# Altium schematic sheet lock_in.SchDoc
size A4
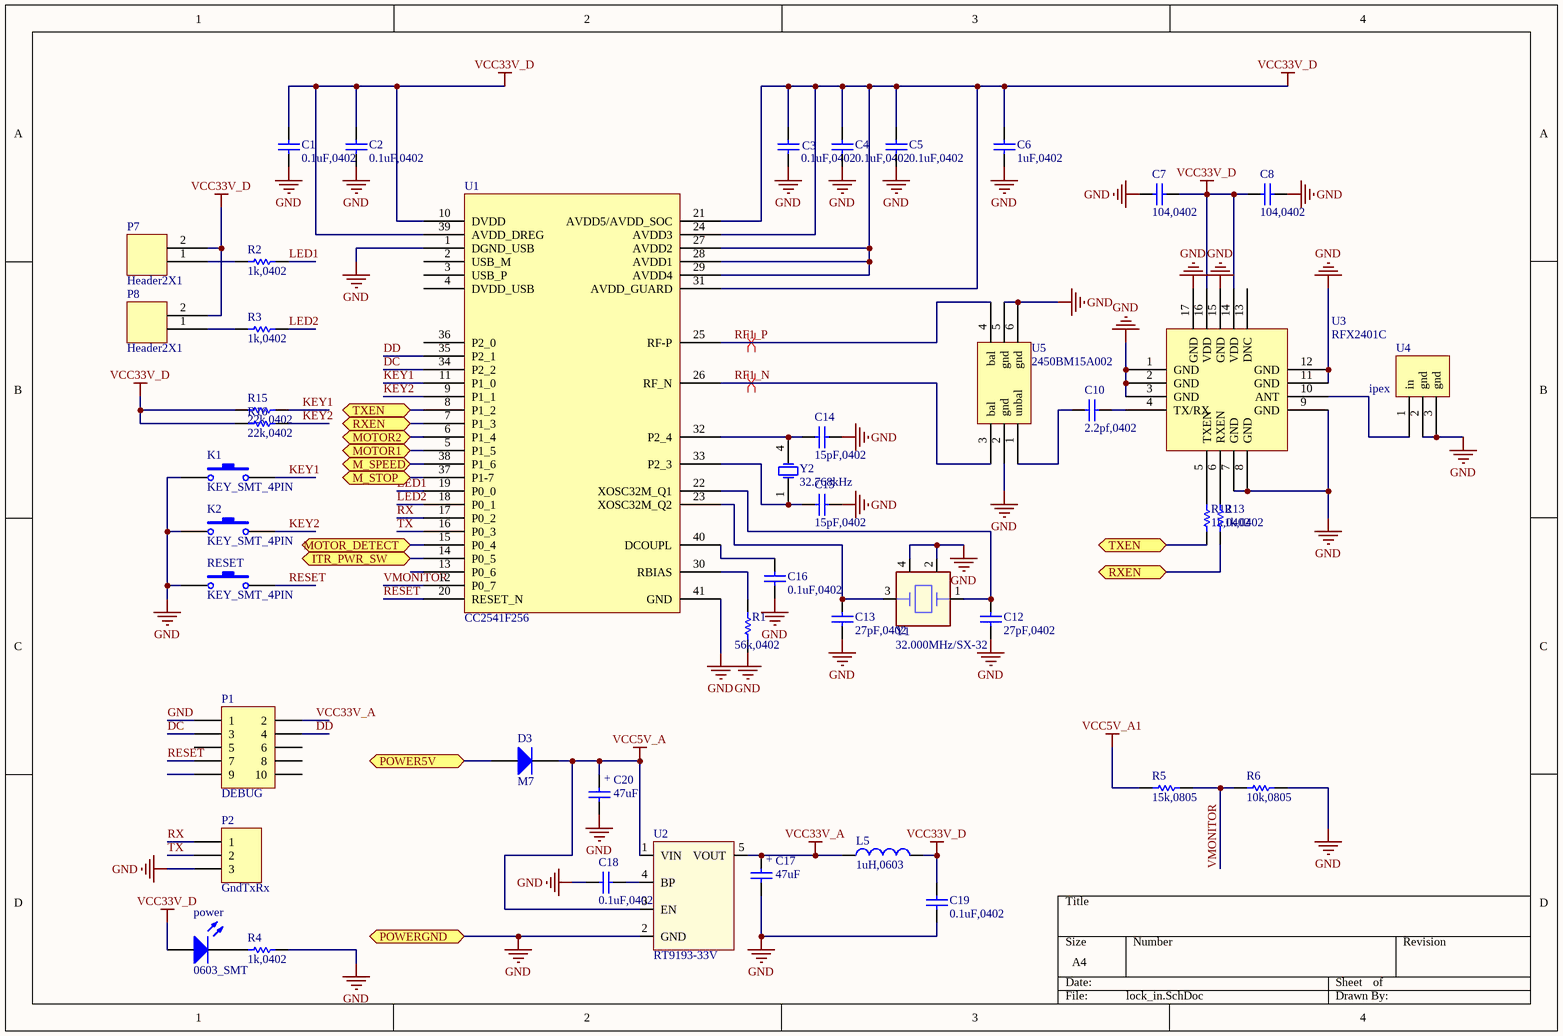
[diagram p0: lock_in.SchDoc]

## Parts
C1  0.1uF,0402  [C0402]
C2  0.1uF,0402  [C0402]
C3  0.1uF,0402  [C0402]
C4  0.1uF,0402  [C0402]
C5  0.1uF,0402  [C0402]
C6  1uF,0402  [C0402]
C7  104,0402  [C0402]
C8  104,0402  [C0402]
C10  2.2pf,0402  [C0402]
C12  27pF,0402  [C0402]
C13  27pF,0402  [C0402]
C14  15pF,0402  [C0402]
C15  15pF,0402  [C0402]
C16  0.1uF,0402  [C0402]
C17  47uF  [3216]
C18  0.1uF,0402  [C0402]
C19  0.1uF,0402  [C0402]
C20  47uF  [3216]
D3  M7  [DO214AC]
K1  KEY_SMT_4PIN  [KEY-SMT]
K2  KEY_SMT_4PIN  [KEY-SMT]
L5  1uH,0603  [L0603]
P1  DEBUG  [HDR2X5]
P2  GndTxRx  [HDR1X3]
P7  Header2X1  [HDR2X1]
P8  Header2X1  [HDR2X1]
power  0603_SMT  [LED0603]
R1  56k,0402  [R0402]
R2  1k,0402  [R0402]
R3  1k,0402  [R0402]
R4  1k,0402  [R0402]
R5  15k,0805  [R0805]
R6  10k,0805  [R0805]
R12  1k,0402  [R0402]
R13  1k,0402  [R0402]
R15  22k,0402  [R0402]
R16  22k,0402  [R0402]
RESET  KEY_SMT_4PIN  [KEY-SMT]
U1  CC2541F256  [PQFP40]
U2  RT9193-33V  [SOT-23-5]
U3  RFX2401C  [QFN16]
U4  ipex  [IPEX]
U5  2450BM15A002  [2450BM15A002]
Y1  32.000MHz/SX-32  [1210]
Y2  32.768kHz  [1206]

## Ports
ITR_PWR_SW, M_SPEED, M_STOP, MOTOR1, MOTOR2, MOTOR_DETECT, POWER5V, POWERGND, RXEN, TXEN

## Nets
GND: C1.1 C2.1 C3.2 C4.1 C5.1 C6.1 C7.1 C8.2 C12.1 C13.1 C14.2 C15.2 C16.1 C17.2 C18.1 C19.1 C20.2 K1.1 K2.1 P1.1 P2.3 R1.1 R4.2 R6.2 RESET.1 U1.1(DGND_USB) U1.41(GND) U2.2(GND) U3.1(GND) U3.2(GND) U3.3(GND) U3.7(GND) U3.8(GND) U3.9(GND) U3.11(GND) U3.12(GND) U3.15(GND) U3.17(GND) U4.2(gnd) U4.3(gnd) U5.2(gnd) U5.5(gnd) U5.6(gnd) Y1.2 Y1.4 ; port POWERGND
VCC5V_A: C20.1 D3.2(K) U2.1(VIN) U2.3(EN)
VCC5V_A1: R5.1
VCC33V_A: C17.1 L5.1 P1.2 U2.5(VOUT)
VCC33V_D: C1.2 C2.2 C3.1 C4.2 C5.2 C6.2 C7.2 C8.1 C19.2 L5.2 P7.2 P8.2 power.1(A) R15.1 R16.1 U1.10(DVDD) U1.21(AVDD5/AVDD_SOC) U1.24(AVDD3) U1.27(AVDD2) U1.28(AVDD1) U1.29(AVDD4) U1.31(AVDD_GUARD) U1.39(AVDD_DREG) U3.14(VDD) U3.16(VDD)
DC: P1.3 U1.34(P2_2)
DD: P1.4 U1.35(P2_1)
ITR_PWR_SW: U1.14(P0_5) ; port ITR_PWR_SW
KEY1: K1.2 R15.2 U1.11(P1_0)
KEY2: K2.2 R16.2 U1.9(P1_1)
LED1: R2.2 U1.19(P0_0)
LED2: R3.2 U1.18(P0_1)
M_SPEED: U1.38(P1_6) ; port M_SPEED
M_STOP: U1.37(P1-7) ; port M_STOP
MOTOR1: U1.5(P1_5) ; port MOTOR1
MOTOR2: U1.6(P1_4) ; port MOTOR2
MOTOR_DETECT: U1.15(P0_4) ; port MOTOR_DETECT
POWER5V: D3.1(A) ; port POWER5V
RESET: P1.7 RESET.2 U1.20(RESET_N)
RF1_N: U1.26(RF_N) U5.3(bal)
RF1_P: U1.25(RF-P) U5.4(bal)
RX: P2.1 U1.17(P0_2)
RXEN: R13.1 U1.7(P1_3) ; port RXEN
TX: P2.2 U1.16(P0_3)
TXEN: R12.1 U1.8(P1_2) ; port TXEN
VMONITOR: R5.2 R6.1 U1.12(P0_7)
NetC10_1: C10.1 U5.1(unbal)
NetC10_2: C10.2 U3.4(TX/RX)
NetC12_2: C12.2 U1.22(XOSC32M_Q1) Y1.1
NetC13_2: C13.2 U1.23(XOSC32M_Q2) Y1.3
NetC14_1: C14.1 U1.32(P2_4) Y2.4(OSC2)
NetC15_1: C15.1 U1.33(P2_3) Y2.1(OSC1)
NetC16_2: C16.2 U1.40(DCOUPL)
NetC18_2: C18.2 U2.4(BP)
NetP7_1: P7.1 R2.1
NetP8_1: P8.1 R3.1
Netpower_2: power.2(K) R4.1
NetR1_2: R1.2 U1.30(RBIAS)
NetR12_2: R12.2 U3.5(TXEN)
NetR13_2: R13.2 U3.6(RXEN)
NetU3_10: U3.10(ANT) U4.1(in)

Not connected (* = marked no-connect by the designer): P1 5 6 8 9 10; U1 2(USB_M) 3(USB_P) 4(DVDD_USB) 13(P0_6) 36(P2_0); U3 13(DNC)

## Layout directives
differential pair: RF1_N, RF1_P

## Notes on the sheet
- (in symbol E_CAP) +

## Library data of the parts
C1-C6 C12-C16 C18 C19 = CAP: Capacitor; Published: 8-Jun-2000; Revision: July-2002: Re-released for DXP Platform.; Publisher: Altium Limited
  C1-C5 C16 C18 C19: Value: 0.1uF
  C6: Value: 1uF
  C12 C13: Value: 27pF
  C14 C15: Value: 15pF
C7 C8 C10 = CAP: Capacitor; Value: 100nF; Published: 8-Jun-2000; Revision: July-2002: Re-released for DXP Platform.; Publisher: Altium Limited
C17 C20 = E_CAP: tantalum capacitor; value: 47uF
D3 = DIODE: value: M1
K1 K2 RESET = KEY
L5 = Inductor: Code_IEC: 1005; Published: 8-Jun-2000; LatestRevisionDate: 17-Jul-2002; LatestRevisionNote: Re-released for DXP Platform.; PackageReference: 0402-A; Publisher: Altium Limited; Code_JEITA: 0402; Value: 1uH
P1 = Header 5X2: Header, 5-Pin, Dual row; LatestRevisionDate: 17-Jul-2002; LatestRevisionNote: Re-released for DXP Platform.; Publisher: Altium Limited
P2 = Header 3: Header, 3-Pin; LatestRevisionDate: 17-Jul-2002; LatestRevisionNote: Re-released for DXP Platform.; Publisher: Altium Limited
P7 P8 = Header 2X1: Header,2-Pin
power = LED
R1-R6 R15 R16 = Res1: Resistor; Published: 8-Jun-2000; Revision: July-2002: Re-released for DXP Platform.; Publisher: Altium Limited
  R1: value: 56k
  R2-R4: value: 1k
  R5: value: 15k
  R6: value: 10k
  R15 R16: value: 22k
R12 R13 = Res1: Resistor; value: 10k; Published: 8-Jun-2000; Revision: July-2002: Re-released for DXP Platform.; Publisher: Altium Limited
U1 = CC254x: TI cc2541F256; value: cc2541F256
U2 = RT9193X: voltage reg; value: RT9193-3.3V
Y1 = CRYSTAL_5: SPXO; value: 32MHz
Y2 = DA740C: crystal; pin to pad: 4>2; value: 32.768kHz